# Altium schematic sheet 04-SNESDRONE_Direct_IO_LEVEL_SHIFTER_1.SchDoc
size A4
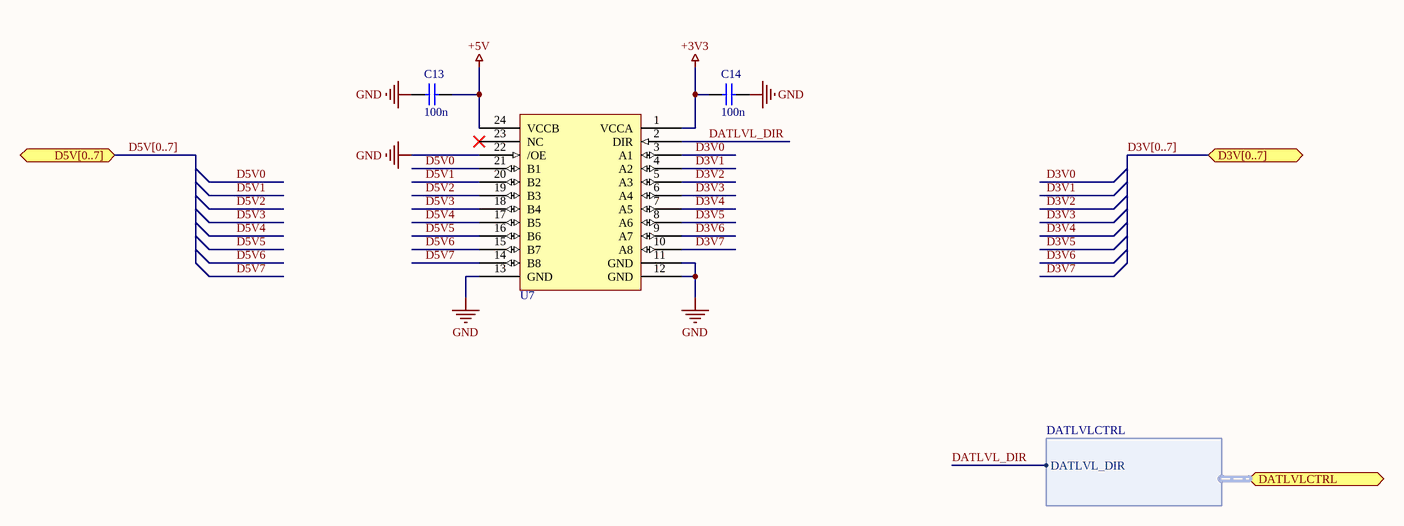
[diagram p0: 04-SNESDRONE_Direct_IO_LEVEL_SHIFTER_1.SchDoc]

## Parts
C13  value 100n  [cap_0603]  (hidden comment: cap_0603)
C14  value 100n  [cap_0603]  (hidden comment: cap_0603)
U7  IC_SN74LVCC3245APWR  [TSSOP24]  (value not drawn)

## Ports
D3V[0..7] (bidir), D5V[0..7] (bidir), DATLVLCTRL (bidir, harness DATLVLCTRL)

## Harnesses
DATLVLCTRL: DATLVL_DIR

## Nets
+3V3: C14.2 U7.1(VCCA)
+5V: C13.1 U7.24(VCCB)
GND: C13.2 C14.1 U7.11(GND) U7.12(GND) U7.13(GND) U7.22(/OE)
D3V0: U7.3(A1)
D3V1: U7.4(A2)
D3V2: U7.5(A3)
D3V3: U7.6(A4)
D3V4: U7.7(A5)
D3V5: U7.8(A6)
D3V6: U7.9(A7)
D3V7: U7.10(A8)
D5V0: U7.21(B1)
D5V1: U7.20(B2)
D5V2: U7.19(B3)
D5V3: U7.18(B4)
D5V4: U7.17(B5)
D5V5: U7.16(B6)
D5V6: U7.15(B7)
D5V7: U7.14(B8)
DATLVL_DIR: U7.2(DIR) ; port DATLVLCTRL.DATLVL_DIR

Not connected (* = marked no-connect by the designer): U7 23(NC)*

## Buses and harness runs
bus D3V[0..7] = port D3V[0..7]
bus D5V[0..7] = port D5V[0..7]

## Library data of the parts
C13 C14 = cap_0603: Capacitor
U7 = IC_SN74LVCC3245APWR: Bus-Transceiver, Produktreihe LVC, 8 Eingänge, 50mA, 7ns, 2.3V bis 5.5V, TSSOP 24; Manufacturer 1: TEXAS INSTRUMENTS; ComponentLink3Description: datsheet; ComponentLink3URL: http://www.ti.com/lit/ds/symlink/sn74lvcc3245a.pdf; ComponentLink4Description: farnell; ComponentLink4URL: https://at.farnell.com/texas-instruments/sn74lvcc3245apwr/bus-transceiver-8bit-tssop-24/dp/2854646?rpsku=rel3%3A2119962&st=2119962; Supplier 1: Farnell; Supplier Part Number 1: 2854646; Manufacturer Part Number 1: SN74LVCC3245APWR; Supplier Unit Price 1: 0,99; Supplier Order Qty 1: 1